# Altium schematic sheet CHECK_AMPERE.SchDoc
size A4; SheetNumber: 4; SheetTotal: 6
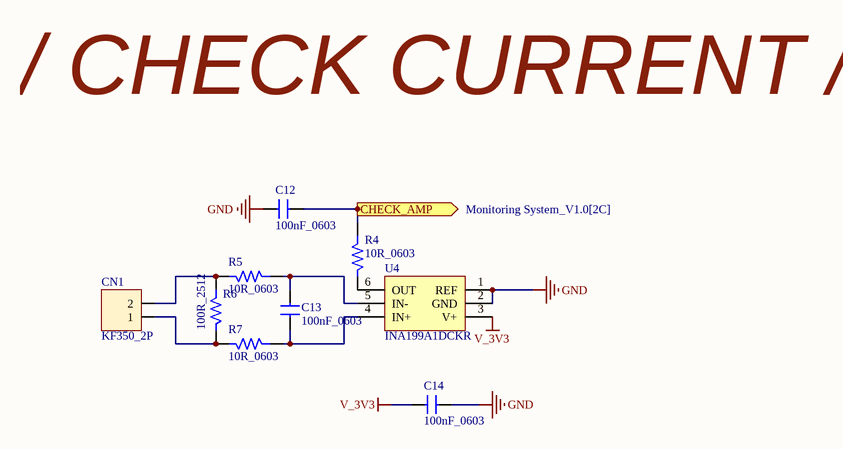
[diagram p0: CHECK_AMPERE.SchDoc]

## Parts
C12  100nF_0603  [CN-SMD-0603]
C13  100nF_0603  [CN-SMD-0603]
C14  100nF_0603  [CN-SMD-0603]
CN1  KF350_2P  [KF350-2P]
R4  10R_0603  [RES-SMD-0603]
R5  10R_0603  [RES-SMD-0603]
R6  100R_2512  [RES-SMD-2512]
R7  10R_0603  [RES-SMD-0603]
U4  INA199A1DCKR  [SC70-6]

## Ports
CHECK_AMP (out, see Monitoring System_V1.0[2C])

## Nets
GND: C12.2 C14.1 U4.1(REF) U4.2(GND)
V_3V3: C14.2 U4.3(V+)
CHECK_AMP: C12.1 R4.2 ; port CHECK_AMP
NetC13_1: C13.1 R7.2 U4.4(IN+)
NetC13_2: C13.2 R5.2 U4.5(IN-)
NetCN1_1: CN1.1 R6.1 R7.1
NetCN1_2: CN1.2 R5.1 R6.2
NetR4_1: R4.1 U4.6(OUT)

## Notes on the sheet
- / CHECK CURRENT /

## Library data of the parts
C12-C14 = CAP 0603 104: Cap SMD, 0.06x0.03 inch, 1.55x0.85 mm - 1608
CN1 = KF350_2P: Terminal Block 3.5mm
R4 R5 R7 = RES 0603 10R: Resistor SMD, 0.06x0.03 inch, 1.55x0.85 mm - 1608, 1/10W
R6 = RES 2512 100R: Resistor SMD, 0.25x0.12 inch, 6.3x3.2 mm - 6332, 1W
U4 = INA199A1DCKR: INA199 26-V, Bidirectional, Zero-Drift, Low- or High-Side, / Voltage-Output, Current-Shunt Monitor